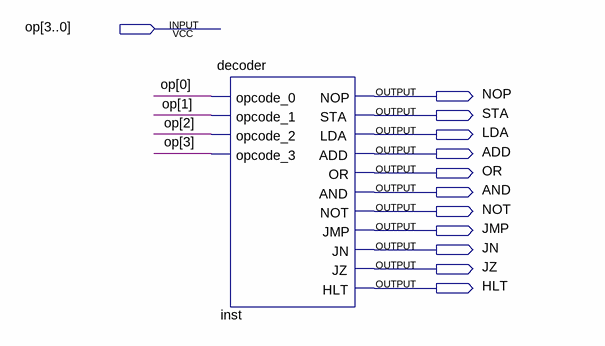
[diagram p0: schematic sheet]
// Quartus schematic teste_externos.bdf as structural Verilog: 1 symbols, 12 pins
module teste_externos (
  input  [3:0] op,
  output NOP,
  output STA,
  output LDA,
  output ADD,
  output OR,
  output AND,
  output NOT,
  output JMP,
  output JN,
  output JZ,
  output HLT
);

  decoder inst (
    .opcode_0(op[0]), .opcode_1(op[1]), .opcode_2(op[2]), .opcode_3(op[3]), .NOP(NOP), .STA(STA), .LDA(LDA),
    .ADD(ADD), .OR(OR), .AND(AND), .NOT(NOT), .JMP(JMP), .JN(JN), .JZ(JZ), .HLT(HLT));
endmodule
